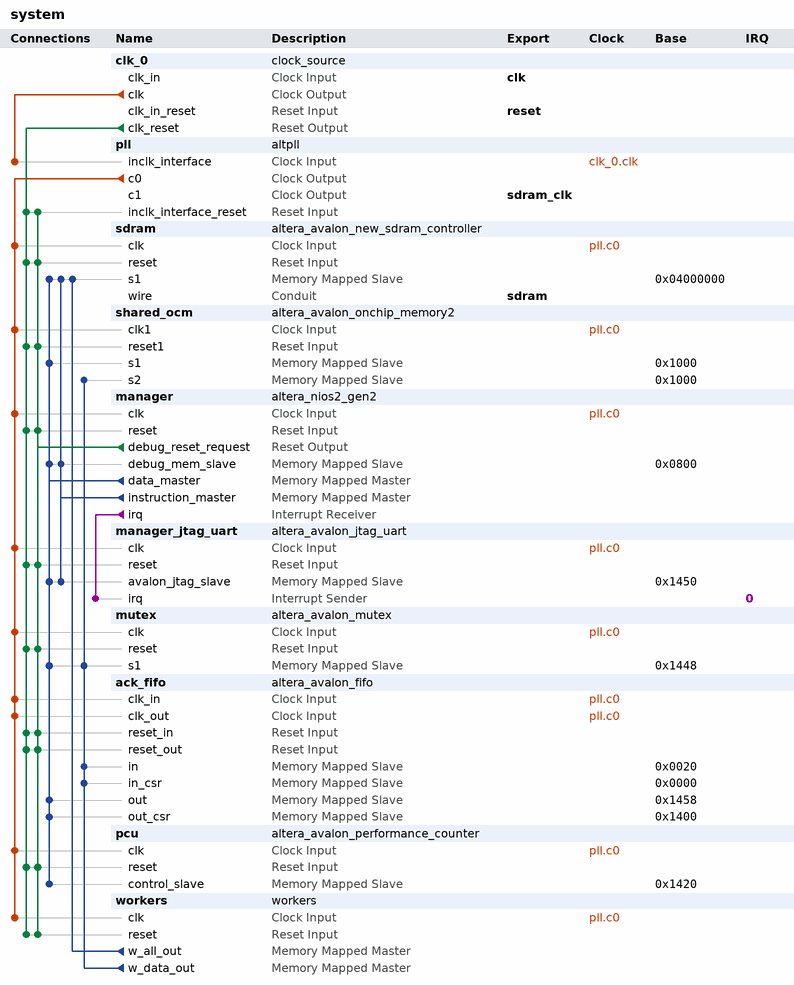
[diagram p0: system contents]
# Platform Designer (Qsys) system system, Cyclone IV E EP4CE22F17C6
# Parameters at their usual value, and those the tool derives, are not listed.
package require -exact qsys 17.0
create_system system
set_project_property DEVICE_FAMILY {Cyclone IV E}
set_project_property DEVICE EP4CE22F17C6

add_instance clk_0 clock_source 17.0
set_instance_parameter_value clk_0 clockFrequency 50000000

add_instance pll altpll 17.0
set_instance_parameter_value pll CLK0_DIVIDE_BY 1
set_instance_parameter_value pll CLK0_MULTIPLY_BY 2
set_instance_parameter_value pll CLK1_DIVIDE_BY 1
set_instance_parameter_value pll CLK1_DUTY_CYCLE 50
set_instance_parameter_value pll CLK1_MULTIPLY_BY 2
set_instance_parameter_value pll CLK1_PHASE_SHIFT -3000
set_instance_parameter_value pll INCLK0_INPUT_FREQUENCY 20000
set_instance_parameter_value pll PORT_ARESET PORT_USED
set_instance_parameter_value pll PORT_LOCKED PORT_UNUSED
set_instance_parameter_value pll PORT_clk1 PORT_USED
set_instance_parameter_value pll PORT_clk2 PORT_UNUSED
set_instance_parameter_value pll PORT_clk3 PORT_UNUSED

add_instance sdram altera_avalon_new_sdram_controller 17.0
set_instance_parameter_value sdram TAC 5.5
set_instance_parameter_value sdram TRCD 20.0
set_instance_parameter_value sdram TRP 20.0
set_instance_parameter_value sdram casLatency 3
set_instance_parameter_value sdram columnWidth 9
set_instance_parameter_value sdram dataWidth 16
set_instance_parameter_value sdram generateSimulationModel false
set_instance_parameter_value sdram model single_Micron_MT48LC4M32B2_7_chip
set_instance_parameter_value sdram numberOfBanks 4
set_instance_parameter_value sdram numberOfChipSelects 1
set_instance_parameter_value sdram powerUpDelay 100.0
set_instance_parameter_value sdram refreshPeriod 15.625
set_instance_parameter_value sdram rowWidth 13

add_instance shared_ocm altera_avalon_onchip_memory2 17.0
set_instance_parameter_value shared_ocm dataWidth 32
set_instance_parameter_value shared_ocm dualPort true
set_instance_parameter_value shared_ocm initMemContent false
set_instance_parameter_value shared_ocm initializationFileName onchip_mem.hex
set_instance_parameter_value shared_ocm memorySize 1024
set_instance_parameter_value shared_ocm singleClockOperation true

add_instance manager altera_nios2_gen2 17.0
set_instance_parameter_value manager cpuID 5
set_instance_parameter_value manager dcache_size 1024
set_instance_parameter_value manager exceptionOffset 18874400
set_instance_parameter_value manager exceptionSlave sdram.s1
set_instance_parameter_value manager icache_size 1024
set_instance_parameter_value manager impl Fast
set_instance_parameter_value manager resetOffset 18874368
set_instance_parameter_value manager resetSlave sdram.s1

add_instance manager_jtag_uart altera_avalon_jtag_uart 17.0
set_instance_parameter_value manager_jtag_uart simInteractiveOptions NO_INTERACTIVE_WINDOWS

add_instance mutex altera_avalon_mutex 17.0
set_instance_parameter_value mutex initialOwner 5
set_instance_parameter_value mutex initialValue 5

add_instance ack_fifo altera_avalon_fifo 17.0
set_instance_parameter_value ack_fifo bitsPerSymbol 16
set_instance_parameter_value ack_fifo channelWidth 8
set_instance_parameter_value ack_fifo errorWidth 8
set_instance_parameter_value ack_fifo fifoDepth 16
set_instance_parameter_value ack_fifo fifoInputInterfaceOptions AVALONMM_WRITE
set_instance_parameter_value ack_fifo fifoOutputInterfaceOptions AVALONMM_READ
set_instance_parameter_value ack_fifo singleClockMode false
set_instance_parameter_value ack_fifo symbolsPerBeat 2
set_instance_parameter_value ack_fifo useIRQ false
set_instance_parameter_value ack_fifo usePacket true
set_instance_parameter_value ack_fifo useReadControl true

add_instance pcu altera_avalon_performance_counter 17.0
set_instance_parameter_value pcu numberOfSections 1

add_instance workers workers 1.0

# connections
add_connection clk_0.clk pll.inclk_interface clock
add_connection pll.c0 ack_fifo.clk_in clock
add_connection pll.c0 ack_fifo.clk_out clock
add_connection pll.c0 manager.clk clock
add_connection pll.c0 manager_jtag_uart.clk clock
add_connection pll.c0 mutex.clk clock
add_connection pll.c0 pcu.clk clock
add_connection pll.c0 sdram.clk clock
add_connection pll.c0 shared_ocm.clk1 clock
add_connection pll.c0 workers.clk clock
add_connection clk_0.clk_reset ack_fifo.reset_in reset
add_connection clk_0.clk_reset ack_fifo.reset_out reset
add_connection clk_0.clk_reset manager.reset reset
add_connection clk_0.clk_reset manager_jtag_uart.reset reset
add_connection clk_0.clk_reset mutex.reset reset
add_connection clk_0.clk_reset pcu.reset reset
add_connection clk_0.clk_reset pll.inclk_interface_reset reset
add_connection clk_0.clk_reset sdram.reset reset
add_connection clk_0.clk_reset shared_ocm.reset1 reset
add_connection clk_0.clk_reset workers.reset reset
add_connection manager.debug_reset_request ack_fifo.reset_in reset
add_connection manager.debug_reset_request ack_fifo.reset_out reset
add_connection manager.debug_reset_request manager.reset reset
add_connection manager.debug_reset_request manager_jtag_uart.reset reset
add_connection manager.debug_reset_request mutex.reset reset
add_connection manager.debug_reset_request pcu.reset reset
add_connection manager.debug_reset_request pll.inclk_interface_reset reset
add_connection manager.debug_reset_request sdram.reset reset
add_connection manager.debug_reset_request shared_ocm.reset1 reset
add_connection manager.debug_reset_request workers.reset reset
add_connection manager.data_master ack_fifo.out avalon
set_connection_parameter_value manager.data_master/ack_fifo.out baseAddress 0x1458
add_connection manager.data_master ack_fifo.out_csr avalon
set_connection_parameter_value manager.data_master/ack_fifo.out_csr baseAddress 0x1400
add_connection manager.data_master manager.debug_mem_slave avalon
set_connection_parameter_value manager.data_master/manager.debug_mem_slave baseAddress 0x0800
add_connection manager.data_master manager_jtag_uart.avalon_jtag_slave avalon
set_connection_parameter_value manager.data_master/manager_jtag_uart.avalon_jtag_slave baseAddress 0x1450
add_connection manager.data_master mutex.s1 avalon
set_connection_parameter_value manager.data_master/mutex.s1 baseAddress 0x1448
add_connection manager.data_master pcu.control_slave avalon
set_connection_parameter_value manager.data_master/pcu.control_slave baseAddress 0x1420
add_connection manager.data_master sdram.s1 avalon
set_connection_parameter_value manager.data_master/sdram.s1 baseAddress 0x04000000
add_connection manager.data_master shared_ocm.s1 avalon
set_connection_parameter_value manager.data_master/shared_ocm.s1 baseAddress 0x1000
add_connection manager.instruction_master manager.debug_mem_slave avalon
set_connection_parameter_value manager.instruction_master/manager.debug_mem_slave baseAddress 0x0800
add_connection manager.instruction_master manager_jtag_uart.avalon_jtag_slave avalon
set_connection_parameter_value manager.instruction_master/manager_jtag_uart.avalon_jtag_slave baseAddress 0x1450
add_connection manager.instruction_master sdram.s1 avalon
set_connection_parameter_value manager.instruction_master/sdram.s1 baseAddress 0x04000000
add_connection workers.w_all_out sdram.s1 avalon
set_connection_parameter_value workers.w_all_out/sdram.s1 baseAddress 0x04000000
add_connection workers.w_data_out ack_fifo.in avalon
set_connection_parameter_value workers.w_data_out/ack_fifo.in baseAddress 0x0020
add_connection workers.w_data_out ack_fifo.in_csr avalon
set_connection_parameter_value workers.w_data_out/ack_fifo.in_csr baseAddress 0x0000
add_connection workers.w_data_out mutex.s1 avalon
set_connection_parameter_value workers.w_data_out/mutex.s1 baseAddress 0x1448
add_connection workers.w_data_out shared_ocm.s2 avalon
set_connection_parameter_value workers.w_data_out/shared_ocm.s2 baseAddress 0x1000
add_connection manager.irq manager_jtag_uart.irq interrupt
set_connection_parameter_value manager.irq/manager_jtag_uart.irq irqNumber 0

# exported interfaces
add_interface clk clock sink
set_interface_property clk EXPORT_OF clk_0.clk_in
add_interface reset reset sink
set_interface_property reset EXPORT_OF clk_0.clk_in_reset
add_interface sdram conduit end
set_interface_property sdram EXPORT_OF sdram.wire
add_interface sdram_clk clock source
set_interface_property sdram_clk EXPORT_OF pll.c1

set_interconnect_requirement {$system} qsys_mm.clockCrossingAdapter HANDSHAKE
set_interconnect_requirement {$system} qsys_mm.enableEccProtection FALSE
set_interconnect_requirement {$system} qsys_mm.insertDefaultSlave FALSE
set_interconnect_requirement {$system} qsys_mm.maxAdditionalLatency 1

save_system system.qsys
